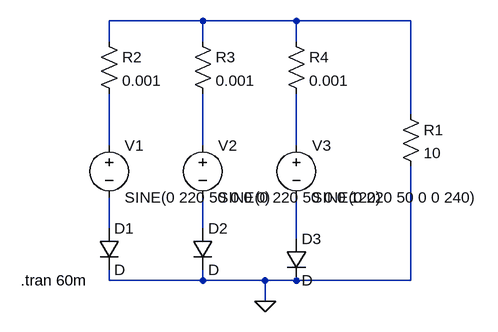
[diagram p0: schematic 3phaseconverterusingdiode.asc]
3phaseconverterusingdiode.asc, the LTspice schematic file:
Version 4
SHEET 1 880 680
WIRE 368 112 224 112
WIRE 512 112 368 112
WIRE 688 112 512 112
WIRE 224 144 224 112
WIRE 368 144 368 112
WIRE 512 144 512 112
WIRE 688 256 688 112
WIRE 224 304 224 224
WIRE 368 304 368 224
WIRE 512 304 512 224
WIRE 224 432 224 384
WIRE 368 432 368 384
WIRE 512 448 512 384
WIRE 224 512 224 496
WIRE 368 512 368 496
WIRE 368 512 224 512
WIRE 464 512 368 512
WIRE 512 512 512 496
WIRE 512 512 464 512
WIRE 688 512 688 336
WIRE 688 512 512 512
WIRE 464 544 464 512
FLAG 464 544 0
SYMBOL voltage 224 288 R0
SYMATTR InstName V1
SYMATTR Value SINE(0 220 50 0 0 0)
SYMBOL voltage 368 288 R0
SYMATTR InstName V2
SYMATTR Value SINE(0 220 50 0 0 120)
SYMBOL voltage 512 288 R0
SYMATTR InstName V3
SYMATTR Value SINE(0 220 50 0 0 240)
SYMBOL res 672 240 R0
SYMATTR InstName R1
SYMATTR Value 10
SYMBOL res 208 128 R0
SYMATTR InstName R2
SYMATTR Value 0.001
SYMBOL res 352 128 R0
SYMATTR InstName R3
SYMATTR Value 0.001
SYMBOL res 496 128 R0
SYMATTR InstName R4
SYMATTR Value 0.001
SYMBOL diode 208 432 R0
SYMATTR InstName D1
SYMBOL diode 352 432 R0
SYMATTR InstName D2
SYMBOL diode 496 448 R0
SYMATTR InstName D3
TEXT 88 512 Left 2 !.tran 60m

The netlist it stands for:
* 3phaseconverterusingdiode.asc
V1 N002 N005 SINE(0 220 50 0 0 0)
V2 N003 N006 SINE(0 220 50 0 0 120)
V3 N004 N007 SINE(0 220 50 0 0 240)
R1 N001 0 10
R2 N001 N002 0.001
R3 N001 N003 0.001
R4 N001 N004 0.001
D1 N005 0 D
D2 N006 0 D
D3 N007 0 D
.model D D
.lib standard.dio
.tran 60m
.backanno
.end